# EAGLE design Washer Machine Status QT-Py ESP32 Neopixel THT (EAGLE 9.6.2)
AUTHOR: Eric Snis; REV: 1
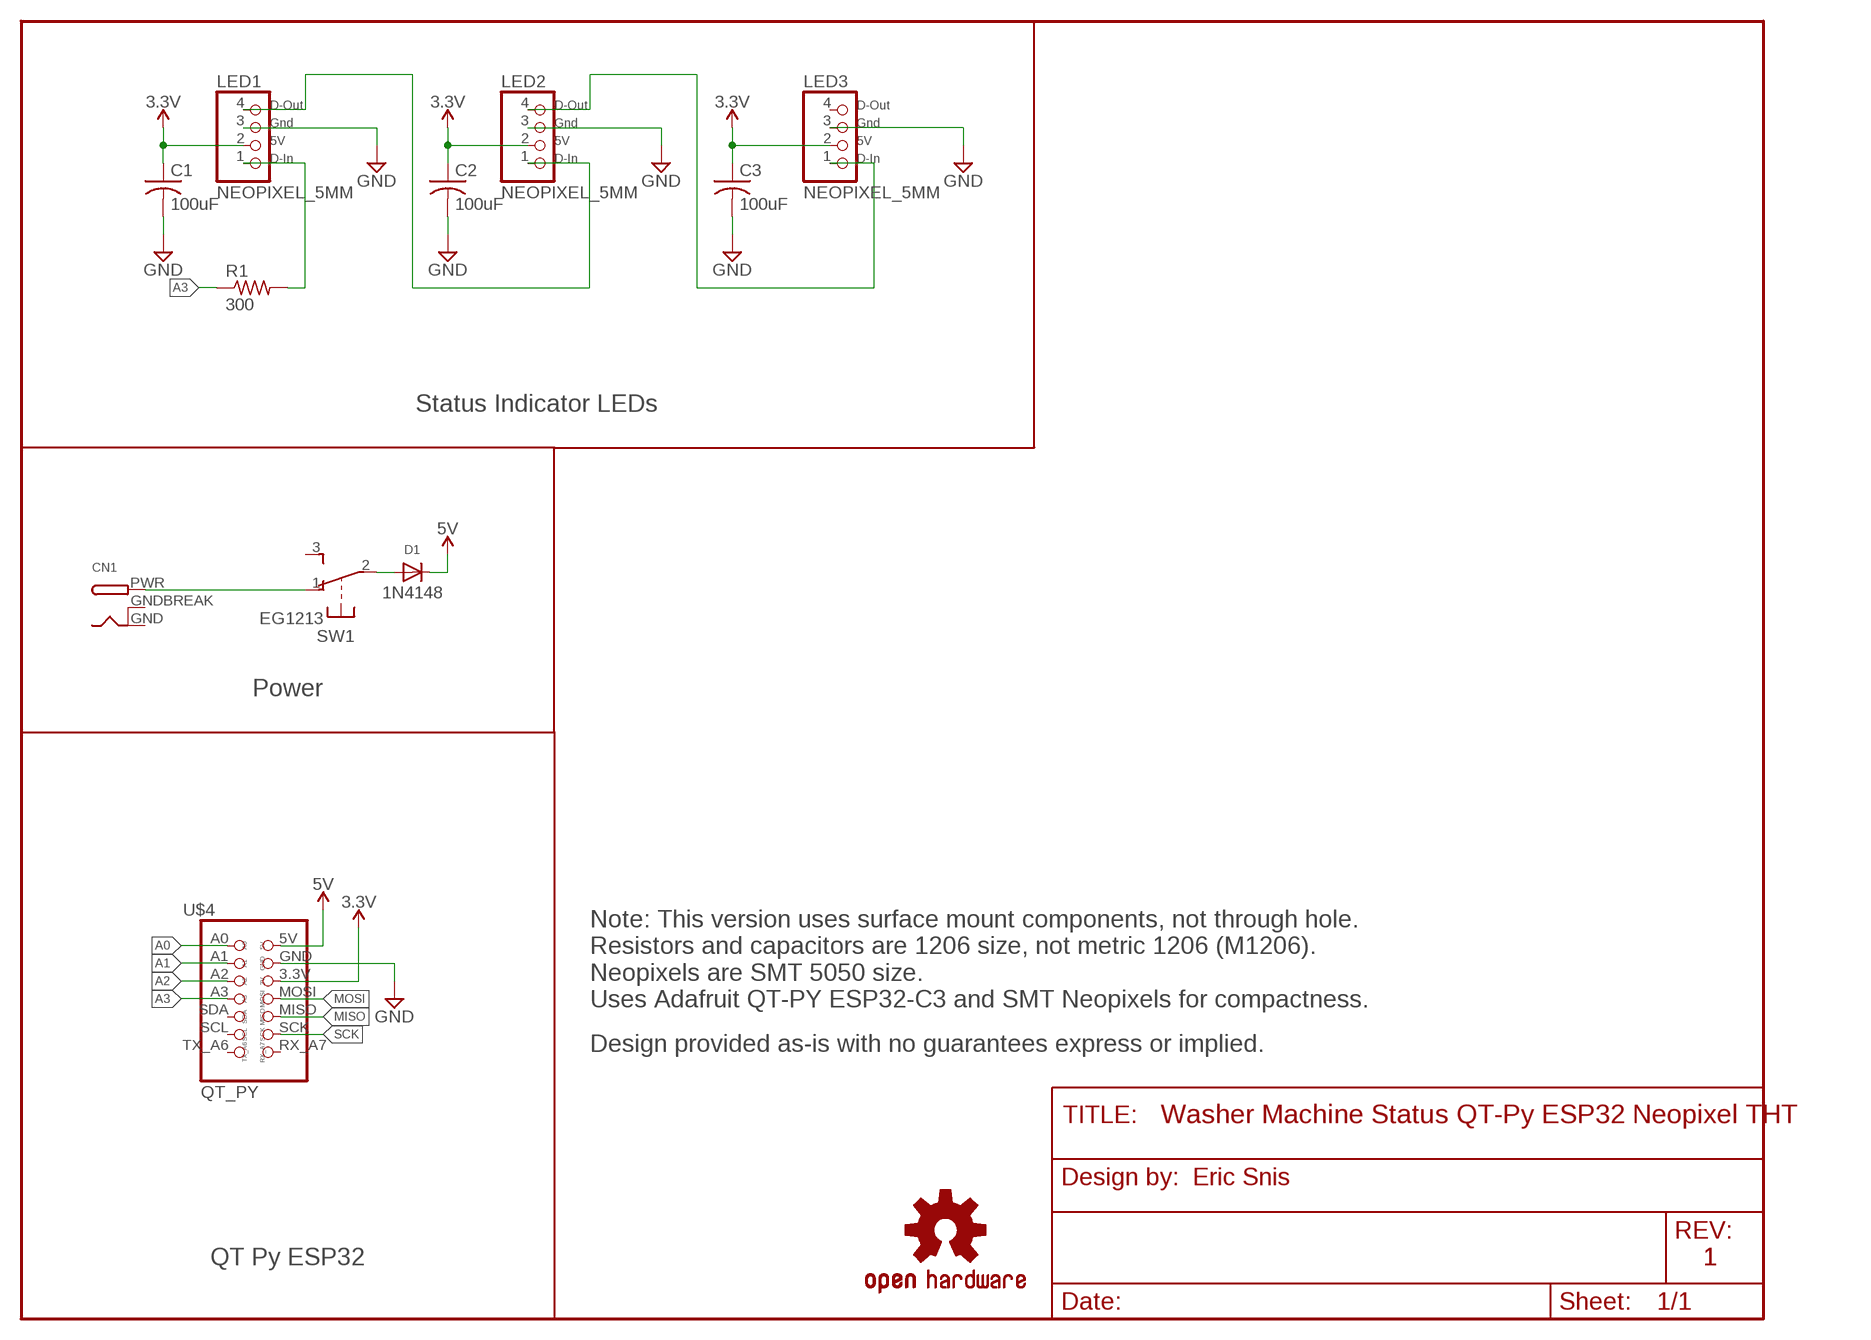
[diagram p0: schematic, sheet 1]

## Parts
C1  100uF  C-USC1206  [C1206]
C2  100uF  C-USC1206  [C1206]
C3  100uF  C-USC1206  [C1206]
CN1  DCBARRELPTH  [DCJACK_2MM_PTH]
D1  1N4148  DIODE_SOD-123FL  [SOD-123FL]
LED1  NEOPIXEL_5MM  [NEOPIXEL_5MM]
LED2  NEOPIXEL_5MM  [NEOPIXEL_5MM]
LED3  NEOPIXEL_5MM  [NEOPIXEL_5MM]
LOGO2  OSHW-LOGOMINI  [OSHW-LOGO-MINI]
R1  300  R_USR1206  [R1206]
SW  EG1213  [EG1213]
U$4  QT_PY  [QT_PY]

## Nets
3.3V: C1.1 C2.1 C3.1 LED1.2(2-5V) LED2.2(2-5V) LED3.2(2-5V) U$4.3.3V(3V)
5V: D1.C U$4.5V
A0: U$4.A0
A1: U$4.A1
A2: U$4.A2
A3: R1.1 U$4.A3
GND: C1.2 C2.2 C3.2 LED1.3(3-GND) LED2.3(3-GND) LED3.3(3-GND) U$4.GND
MISO: U$4.MISO
MOSI: U$4.MOSI
N$1: CN1.PWR SW.1(1:O)
N$2: LED1.4(4-D_OUT) LED2.1(1-D_IN)
N$3: LED1.1(1-D_IN) R1.2
N$4: LED2.4(4-D_OUT) LED3.1(1-D_IN)
N$5: D1.A SW.2(1:P)
SCK: U$4.SCK
Unconnected: LED3.4(4-D_OUT) SW.3(1:S) SW.MT1(MT) SW.MT2(MT) U$4.RX_A7 U$4.SCL U$4.SDA U$4.TX_A6

## Notes on the sheet
- Status Indicator LEDs
- Power
- Note: This version uses surface mount components, not through hole.
  Resistors and capacitors are 1206 size, not metric 1206 (M1206).
  Neopixels are SMT 5050 size.
  Uses Adafruit QT-PY ESP32-C3 and SMT Neopixels for compactness.
- Design provided as-is with no guarantees express or implied.
- QT Py ESP32

## Power pins joined to a net without a drawn wire
GND: CN1.GND
GNDBREAK: CN1.GNDBREAK

## Library data of the parts
C1-C3 = adafruit:C-US: CAPACITOR, American symbol
CN1 = connectors:DCBARREL: 2.0mm DC Barrel Jack DCJACK_2MM_PTH - Through Hole Jack (4UConnector: 05537)
D1 = adafruit:DIODE: Diode SMADIODE - SMA Surface Mount Package 20V 1A Schottky Diode Digikey: 641-1014-6-ND DO-1N4148 - Through Hole Small Current Diode SOD-123 20V 1 A (.5mV Vf) Schottky Diode - Digikey: MBRX120TPMSCT-ND SOD-323 10V 570mA (.38mV Vf, 3ns) Schottky Diode - Digikey: ZLLS410CT-ND SOD-523 30V 30mA Schottky Diode (RB751S-40TE61) - Digikey: RB751S-40TE61CT-ND SOT23-R/W - SOT23 Package (R = Solder Paste/Reflow Ovens, W = Hand-Soldering) BAT54Film 40V 300mA - Digikey: 497-7162-1-ND
LED1-LED3 = Transistors MOSFETs:NEOPIXEL: NeoPixel LED RGB LED 0.05" pitch
LOGO2 = SparkFun-Aesthetics:OSHW-LOGO: Open-Source Hardware (OSHW) Logo This logo indicates the piece of hardware it is found on incorporates a OSHW license and/or adheres to the definition of open source hardware found here: http://freedomdefined.org/OSHW
R1 = passives:R_US: Resistor 7mm pin spacing
SW = adafruit:EG1213: E-Switch right-angle slide SPDT Part #EG1213 http://www.ladyada.net/library/eagle
U$4 = connectors:QT_PY: Adafruit QT Py

## Net classes
1 GND: drill 0.305 mm, clearance 0.127 mm

## Board
Washer and Dryer status board Neopixel variant Uses Adafruit QT-Py ESP32-C3 board. Uses WS2812 / NeoPixel SMT LEDs 5mm through hole.
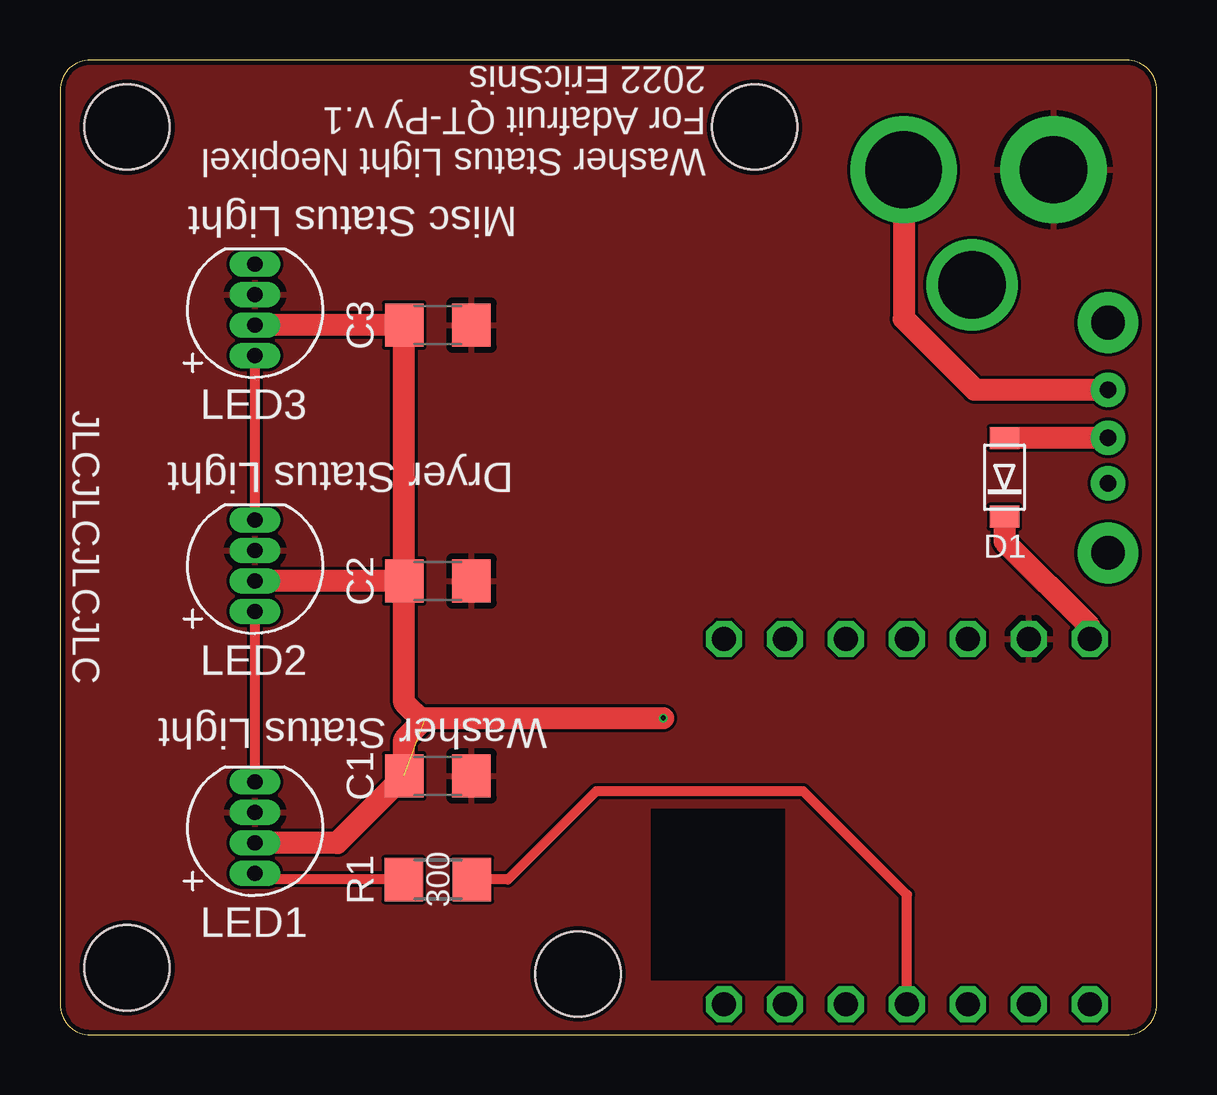
[diagram p1: board, top side]
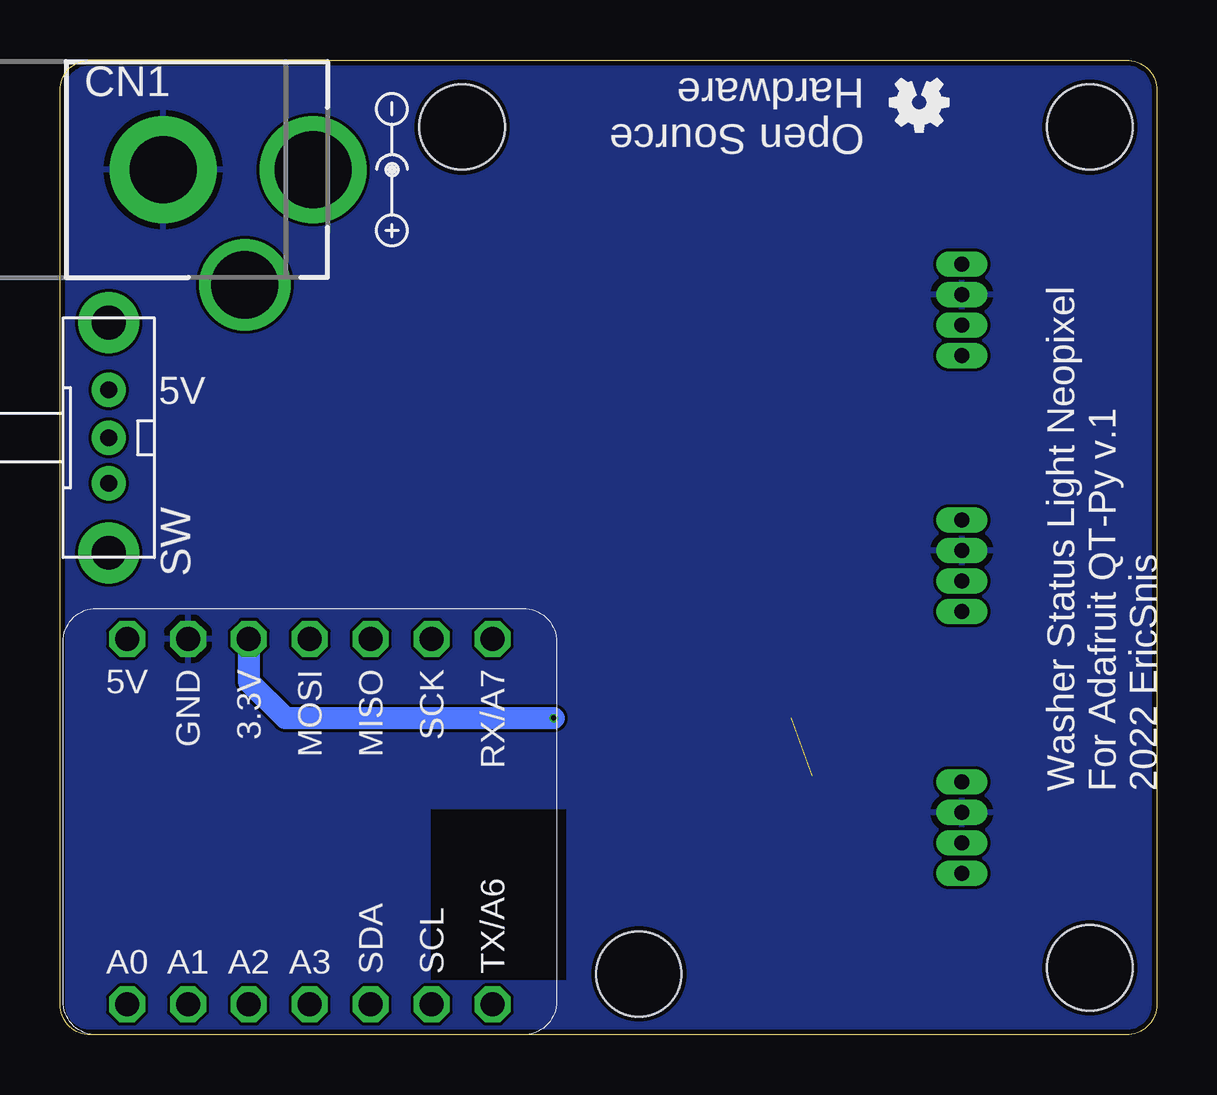
[diagram p2: board, bottom side, seen from below]

Size 45.72 x 40.64 mm. Coordinates in mm from the lower left corner, seen from the top.
Outline: 1.27,0 44.45,0 arc90 45.72,1.27 45.72,39.37 arc90 44.45,40.64 1.27,40.64 arc90 0,39.37 0,1.27 arc90 1.27,0
Copper layers (1*16): Top 0.035559375mm / dielectric 1.6mm / Bottom 0.035559375mm
Design rules "Digikey DKRed": minimum track width 5mil, minimum drill 8mil, track to track 5mil, track to pad 5mil, pad to pad 5mil, via to via 5mil, smd to smd 5mil, copper to edge 8mil, drill to drill 6mil, minimum pad ring 5mil, minimum via ring 3mil, stop-mask expansion 2.5mil, vias tented up to drill 0mil, thermal gap 10mil
Holes 3.56 mm at 2.79,2.79 21.59,2.54 2.79,37.85 28.96,37.85

### Footprints (pad centres in the part's own frame; a part is rotated, then mirrored left to right if it is on the bottom)
C1206 = smd 1.6 x 1.8: 1 -1.4,0; 2 1.4,0
DCJACK_2MM_PTH = drill 2.8 pad 4.445: GND 0,7.35 | drill 2.8: GNDBREAK 4.8,10.75 | drill 3.2 pad 4.445: PWR 0,13.6
SOD-123FL = smd 0.91 x 1.22: A 1.637,0; C -1.637,0
NEOPIXEL_5MM = drill 0.635 pad 1.067 long: 1 -1.905,0; 2 -0.635,0; 3 0.635,0; 4 1.905,0
R1206 = smd 1.6 x 1.803: 1 -1.422,0; 2 1.422,0
EG1213 = drill 0.7 pad 1.422: 1 -2,0; 2 0,0; 3 1.9,0 | drill 1.4 pad 2.54: MT1 -4.8,0; MT2 4.8,0
QT_PY = drill 1 octagon: 3.3V 7.62,2.54; 5V 7.62,7.62; A0 -7.62,7.62; A1 -7.62,5.08; A2 -7.62,2.54; A3 -7.62,0; GND 7.62,5.08; MISO 7.62,-2.54; MOSI 7.62,0; RX_A7 7.62,-7.62; SCK 7.62,-5.08; SCL -7.62,-5.08; SDA -7.62,-2.54; TX_A6 -7.62,-7.62

### Placement (x,y rotation side)
C1  15.75,10.79 0 top
C2  15.75,18.92 0 top
C3  15.75,29.59 0 top
CN1  48.77,36.07 270 bottom
D1  39.37,23.24 90 top
LED1  8.13,8.64 90 top
LED2  8.13,19.56 90 top
LED3  8.13,30.23 90 top
LOGO2  9.91,38.86 180 bottom
R1  15.75,6.48 180 top
SW  43.69,24.89 270 bottom
U$1  [CENTER-POS-SMALL]  31.88,36.07 90 bottom
U$4  35.31,8.89 90 bottom

### Tracks (layer width: path | path; a pad name or v marks a point on that pad's centre or on a via)
3.3V  (via drill 0.2)  (1 unrouted)
  Top 0.914: 15.24,13.21 v25.15,13.21 | C2.1 14.35,13.85 15.11,13.08 14.35,12.32 C1.1 11.55,8 LED1.2 | C2.1 C3.1 LED3.2 | C2.1 LED2.2
  Bottom 0.914: U$4.3.3V 37.85,14.73 36.32,13.21 v25.15,13.21
5V
  Top 0.914: D1.C 39.37,20.57 42.93,17.02 U$4.5V
A3
  Top 0.406: U$4.A3 35.31,5.84 30.99,10.16 22.35,10.16 18.67,6.48 R1.1
ANT
  cutout Top (isolate 0): 24.64,2.29 30.23,2.29 30.23,9.4 24.64,9.4
ANT1
  cutout Bottom (isolate 0): 24.64,2.29 30.23,2.29 30.23,9.4 24.64,9.4
GND
  pour Top (isolate 0.001): 1.27,0 44.45,0 arc90 45.72,1.27 45.72,39.37 arc90 44.45,40.64 1.27,40.64 arc90 0,39.37 0,1.27 arc90
  pour Bottom (isolate 0.001): 1.27,0 44.45,0 arc90 45.72,1.27 45.72,39.37 arc90 44.45,40.64 1.27,40.64 arc90 0,39.37 0,1.27 arc90
N$1
  Top 0.914: CN1.PWR 35.17,29.86 38.13,26.89 SW.1
N$2
  Top 0.406: LED1.4 LED2.1
N$3
  Top 0.406: 13.78,5.93 R1.2 8.38,6.48 LED1.1
N$4
  Top 0.406: LED2.4 LED3.1
N$5
  Top 0.61: SW.2 43.67,24.88
  Top 0.914: 43.67,24.88 D1.A

### Text on the board
tPlace: Washer Status Light Neopixel / For Adafruit QT-Py v.1 / 2022 EricSnis | Misc Status Light | Dryer Status Light | JLCJLCJLCJLC | Washer Status Light
bPlace: Open Source / Hardware | 5V | Washer Status Light Neopixel / For Adafruit QT-Py v.1 / 2022 EricSnis